# Altium schematic sheet TX_PA.SchDoc
size B; SheetNumber: 4; SheetTotal: 12
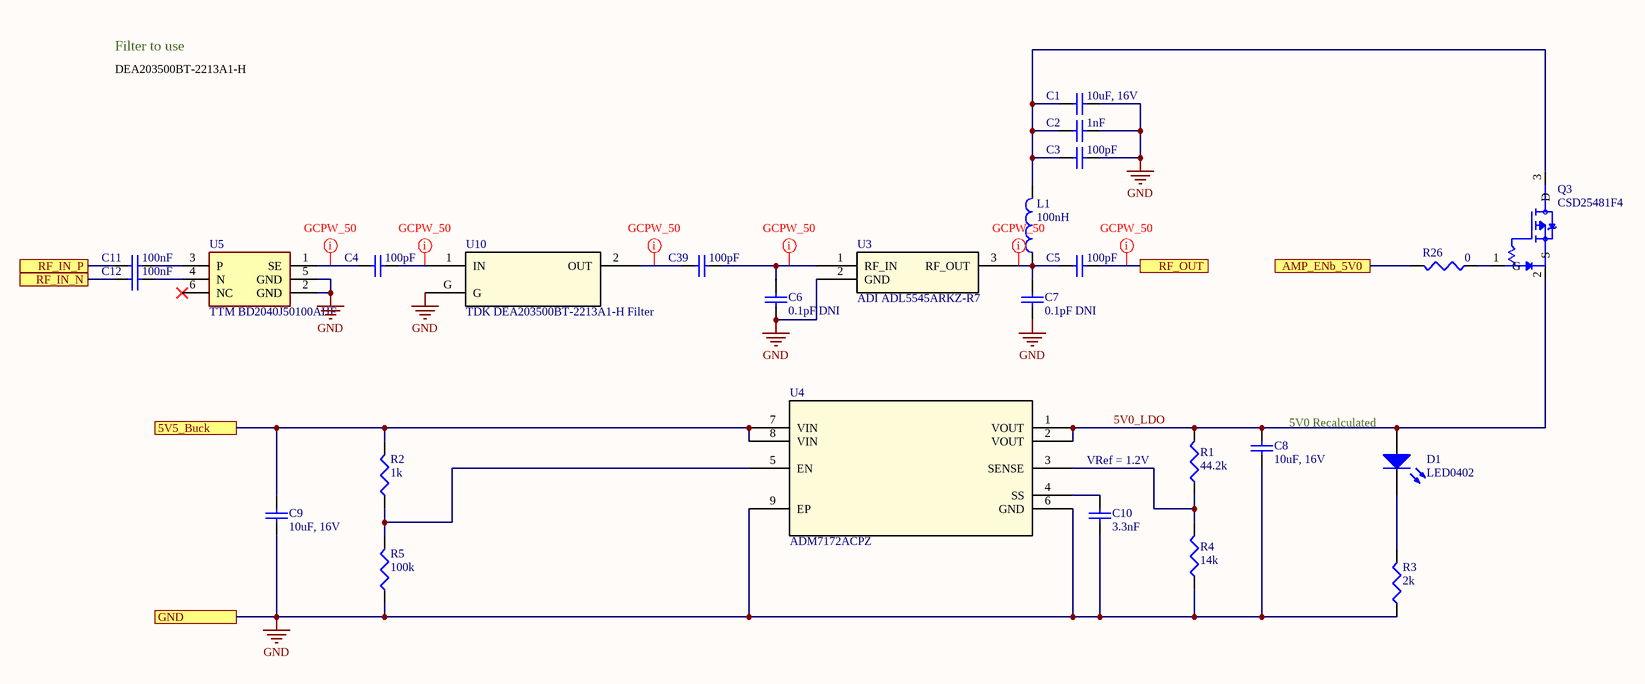
[diagram p0: TX_PA.SchDoc]

## Parts
C1  10uF, 16V  [SMD-0603]
C2  1nF  [SMD-0402]
C3  100pF  [SMD-0402]
C4  100pF  [SMD-0402]
C5  100pF  [SMD-0402]
C6  0.1pF DNI  [SMD-0402]
C7  0.1pF DNI  [SMD-0402]
C8  10uF, 16V  [SMD-0603]
C9  10uF, 16V  [SMD-0603]
C10  3.3nF  [Johanson-0201]
C11  100nF  [SMD-0402]
C12  100nF  [SMD-0402]
C39  100pF  [SMD-0402]
D1  LED0402  [LED-0402]
L1  100nH  [SMD-0402]
Q3  CSD25481F4  [CSD25481F4]
R1  44.2k  [SMD-0402]
R2  1k  [SMD-0402]
R3  2k  [SMD-0402]
R4  14k  [SMD-0402]
R5  100k  [SMD-0402]
R26  0  [SMD-0402]
U3  ADI ADL5545ARKZ-R7  [Analog Devices ADL5545ARKZ]
U4  ADM7172ACPZ  [ADM7172_VIA_NOSILK]
U5  TTM BD2040J50100AHF  [Anaren Balun BD2040J50100AHF]
U10  TDK DEA203500BT-2213A1-H Filter  [TDK DEA203500BT-2213A1-H Bandpass Filter]

## Ports
5V5_Buck, AMP_ENb_5V0, GND, RF_IN_N, RF_IN_P, RF_OUT

## Nets
GND: C1.1 C2.2 C3.2 C6.1 C7.1 C8.1 C9.1 C10.1 R3.1 R4.1 R5.1 U3.2(GND) U4.6(GND) U4.9(EP) U5.2(GND) U5.5(GND) U10.G ; port GND
5V0_LDO: C8.2 D1.2(A) Q3.2(S) R1.2 U4.1(VOUT) U4.2(VOUT)
5V5_Buck: C9.2 R2.2 U4.7(VIN) U4.8(VIN) ; port 5V5_Buck
AMP_ENb_5V0: R26.2 ; port AMP_ENb_5V0
RF_IN_N: C12.1 ; port RF_IN_N
RF_IN_P: C11.1 ; port RF_IN_P
RF_OUT: C5.2 ; port RF_OUT
NetC1_2: C1.2 C2.1 C3.1 L1.2 Q3.3(D)
NetC4_1: C4.1 U5.1(SE)
NetC4_2: C4.2 U10.1(IN)
NetC5_1: C5.1 C7.2 L1.1 U3.3(RF_OUT)
NetC6_2: C6.2 C39.2 U3.1(RF_IN)
NetC10_2: C10.2 U4.4(SS)
NetC11_2: C11.2 U5.3(P)
NetC12_2: C12.2 U5.4(N)
NetC39_1: C39.1 U10.2(OUT)
NetD1_1: D1.1(K) R3.2
NetQ3_1: Q3.1(G) R26.1
NetR1_1: R1.1 R4.2 U4.3(SENSE)
NetR2_1: R2.1 R5.2 U4.5(EN)

Not connected (* = marked no-connect by the designer): U5 6(NC)*

## Layout directives
net class GCPW_50: NetC4_1, NetC4_2, NetC5_1, NetC6_2, NetC39_1, RF_OUT

## Notes on the sheet
- DEA203500BT-2213A1-H
- Filter to use
- 5V0 Recalculated
- VRef = 1.2V

## Library data of the parts
C1 C8 C9 = CAP0603: Ceramic Capacitor 0603
C2-C7 C11 C12 C39 = CAP0402: Ceramic Capacitor 0402
C10 = CAP0201: Capacitor 0201 Imperial
D1 = LED0402: LED 0402
L1 = L0402: Inductor 0402
Q3 = CSD25481F4: -20V, P ch NexFET MOSFET, single LGA 0.6x1.0, 105mOhm 3-PICOSTAR -55 to 150; MF: Texas Instruments; MP: CSD25481F4; Purchase-URL: https://pricing.snapeda.com/search/part/CSD25481F4/?ref=eda; Price: None; SnapEDA_Link: https://www.snapeda.com/parts/CSD25481F4/Texas%20Instruments/view-part/808987/?ref=snap; Check_prices: https://www.snapeda.com/parts/CSD25481F4/Texas%20Instruments/view-part/808987/?ref=eda; Package: PICOSTAR-3 Texas Instruments; Availability: Good; Value: *
R1-R5 R26 = RES0402: Resistor-0402
U3 = ADI ADL5545ARKZ-R7: No Description Available; Mfr_Name: Analog Devices Inc; RefDes: RefDes; Type: Type
U4 = ADM7172ACPZ: 6.5V, 2A, Ultralow Noise, High PSRR, Fast Transient Response CMOS LDO; Value: Value; Type: Type; RefDes: RefDes
U5 = Anaren Balun - BD2040J50100AHF: Filter; Manufacturer_Name: ANAREN; Datasheet Link: https://cdn.anaren.com/product-documents/Xinger/BalunTransformers/BD2040J50100AHF/BD2040J50100AHF_DataSheet(Rev_C).pdf; Height: 0.78mm; Manufacturer_Part_Number: BD2040J50100AHF; Mouser Part Number: 620-BD2040J50100AH; Mouser Price/Stock: https://www.mouser.co.uk/ProductDetail/Anaren/BD2040J50100AHF?qs=BDRISUKNLIfZZVKLkyHFlw%3D%3D
U10 = TDK DEA203500BT-2213A1-H Filter: 3.5 GHz Center Freq BPF; Mfr_Name: TDK; RefDes: RefDes; Type: Type